# EAGLE schematic f_bootstrap_cap_boost_L (EAGLE 9.2.1)
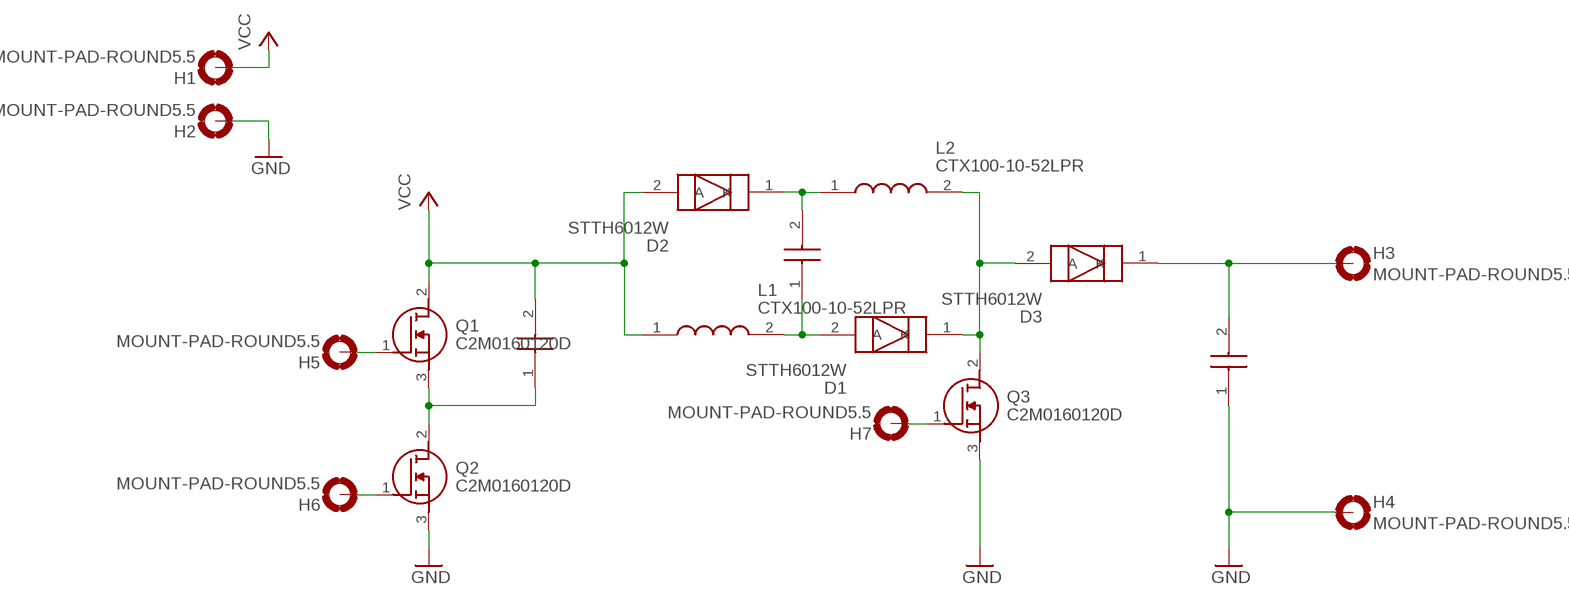
[diagram p0: schematic, sheet 1]

## Parts
C1  B32774D4505K000  [B32774D4505K000]
C2  B32774D4505K000  [B32774D4505K000]
D1  STTH6012W  [TO1090P515X1560X2445-2P]
D2  STTH6012W  [TO1090P515X1560X2445-2P]
D3  STTH6012W  [TO1090P515X1560X2445-2P]
H1  MOUNT-PAD-ROUND5.5  [5,5-PAD]
H2  MOUNT-PAD-ROUND5.5  [5,5-PAD]
H3  MOUNT-PAD-ROUND5.5  [5,5-PAD]
H4  MOUNT-PAD-ROUND5.5  [5,5-PAD]
H5  MOUNT-PAD-ROUND5.5  [5,5-PAD]
H6  MOUNT-PAD-ROUND5.5  [5,5-PAD]
H7  MOUNT-PAD-ROUND5.5  [5,5-PAD]
L1  CTX100-10-52LPR  [CTX1001052LPR]
L2  CTX100-10-52LPR  [CTX1001052LPR]
Q1  C2M0160120D  [TO544P521X1594X2550-3P]
Q2  C2M0160120D  [TO544P521X1594X2550-3P]
Q3  C2M0160120D  [TO544P521X1594X2550-3P]
U$1  B32774D4505K000  [B32774D4505K000]

## Nets
GND: C2.1 H2.B5,5(MOUNT) H4.B5,5(MOUNT) Q2.3(S) Q3.3(S)
N$1: C1.1 Q1.3(S) Q2.2(D)
N$2: C2.2 D3.1(K) H3.B5,5(MOUNT)
N$3: D1.1(K) D3.2(A) L2.2 Q3.2(D)
N$4: H6.B5,5(MOUNT) Q2.1(G)
N$5: H5.B5,5(MOUNT) Q1.1(G)
N$6: D1.2(A) L1.2 U$1.1
N$7: H7.B5,5(MOUNT) Q3.1(G)
N$8: D2.1(K) L2.1 U$1.2
VCC: C1.2 D2.2(A) H1.B5,5(MOUNT) L1.1 Q1.2(D)

## Library data of the parts
C1 C2 U$1 = SamacSys_Parts:B32774D4505K000: Epcos B32774D 5F Polypropylene Film Capacitor 450 V dc 10% Source: Datasheet <https://en.tdk-electronics.tdk.com/inf/20/20/db/fc_2009/MKP_B32774_778.pdf>; ARROW_PART_NUMBER: B32774D4505K000; ARROW_PRICE-STOCK: https://www.arrow.com/en/products/b32774d4505k000/epcos-tdk; DESCRIPTION: Epcos B32774D 5F Polypropylene Film Capacitor 450 V dc 10%; HEIGHT: 21mm; MANUFACTURER_NAME: EPCOS; MANUFACTURER_PART_NUMBER: B32774D4505K000; RS_PART_NUMBER: 1726009; RS_PRICE-STOCK: http://uk.rs-online.com/web/p/products/1726009
D1-D3 = SamacSys_Parts:STTH6012W: STTH6012W, Fast Recovery Rectifier Diode, Switching 60A max, 1200V 125ns, 2-Pin, DO-247 Source: Datasheet <http://www.st.com/web/en/resource/technical/document/datasheet/CD00096472.pdf>; ALLIED_NUMBER: 70014108; ALLIED_PRICE-STOCK: http://www.alliedelec.com/stmicroelectronics-stth6012w/70014108/; ARROW_PART_NUMBER: STTH6012W; ARROW_PRICE-STOCK: https://www.arrow.com/en/products/stth6012w/stmicroelectronics; DESCRIPTION: STTH6012W, Fast Recovery Rectifier Diode, Switching 60A max, 1200V 125ns, 2-Pin, DO-247; HEIGHT: 5.15mm; MANUFACTURER_NAME: STMicroelectronics; MANUFACTURER_PART_NUMBER: STTH6012W; RS_PART_NUMBER: 6870818; RS_PRICE-STOCK: http://uk.rs-online.com/web/p/rectifier-schottky-diodes/6870818/?source=DS
H1-H7 = holes:MOUNT-PAD-ROUND: MOUNTING PAD, round
L1 L2 = SamacSys_Parts:CTX100-10-52LPR: Fixed Inductors 100uH 13A Source: Datasheet <http://www.cooperindustries.com/content/dam/public/bussmann/Electronics/Resources/product-datasheets/Bus_Elx_DS_PM 4304_LPCI_Series.pdf>; ARROW_PART_NUMBER: CTX100-10-52LPR; DESCRIPTION: Fixed Inductors 100uH 13A; HEIGHT: 27.5mm; MANUFACTURER_NAME: Eaton; MANUFACTURER_PART_NUMBER: CTX100-10-52LPR
Q1-Q3 = SamacSys_Parts:C2M0160120D: Wolfspeed C2M0160120D N-channel SiC MOSFET Transistor, 19 A, 1200 V, 3-Pin TO-247 Source: Datasheet <http://www.wolfspeed.com/media/downloads/169/C2M0160120D.pdf>; ARROW_PART_NUMBER: C2M0160120D; ARROW_PRICE-STOCK: http://uk.rs-online.com/web/p/products/1629709; DESCRIPTION: Wolfspeed C2M0160120D N-channel SiC MOSFET Transistor, 19 A, 1200 V, 3-Pin TO-247; HEIGHT: 5.21mm; MANUFACTURER_NAME: Wolfspeed; MANUFACTURER_PART_NUMBER: C2M0160120D; RS_PART_NUMBER: 1629709; RS_PRICE-STOCK: http://uk.rs-online.com/web/p/products/1629709